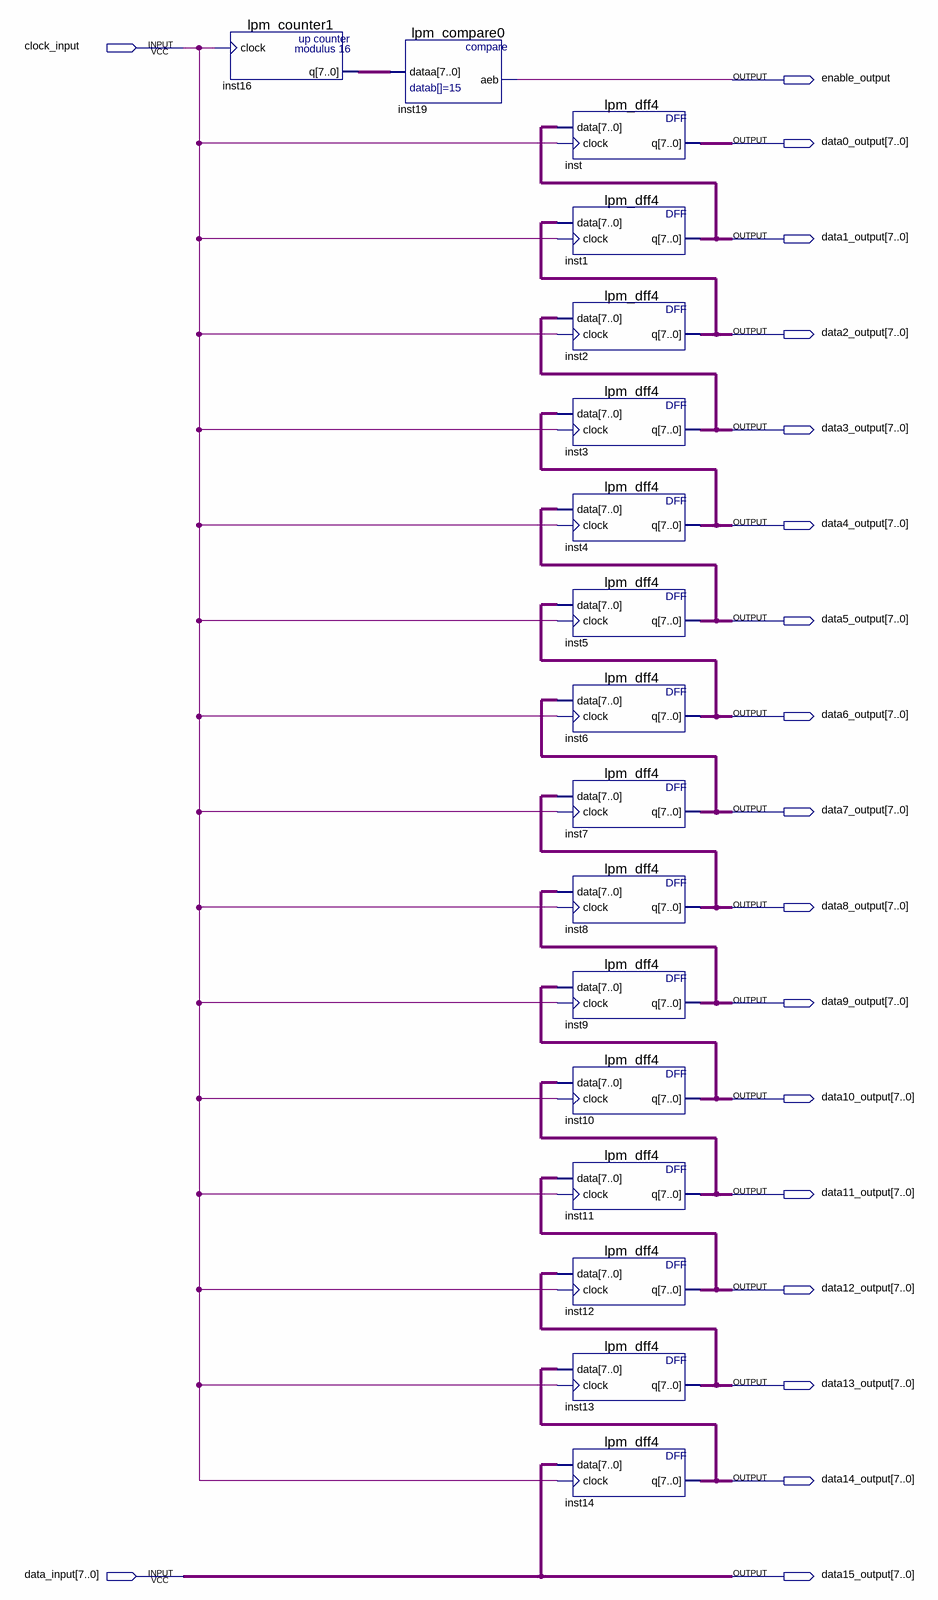
[diagram p0: schematic sheet]
// Quartus schematic to_parallel.bdf as structural Verilog: 17 symbols, 19 pins
module to_parallel (
  input  clock_input,
  input  [7:0] data_input,
  output enable_output,
  output [7:0] data0_output,
  output [7:0] data1_output,
  output [7:0] data2_output,
  output [7:0] data3_output,
  output [7:0] data4_output,
  output [7:0] data5_output,
  output [7:0] data6_output,
  output [7:0] data7_output,
  output [7:0] data8_output,
  output [7:0] data9_output,
  output [7:0] data10_output,
  output [7:0] data11_output,
  output [7:0] data12_output,
  output [7:0] data13_output,
  output [7:0] data14_output,
  output [7:0] data15_output
);

  wire [7:0] inst16_q;

  lpm_counter1 inst16 (.clock(clock_input), .q(inst16_q));
  lpm_compare0 inst19 (.dataa(inst16_q), .aeb(enable_output));
  lpm_dff4 inst (.data(data1_output), .clock(clock_input), .q(data0_output));
  lpm_dff4 inst1 (.data(data2_output), .clock(clock_input), .q(data1_output));
  lpm_dff4 inst2 (.data(data3_output), .clock(clock_input), .q(data2_output));
  lpm_dff4 inst3 (.data(data4_output), .clock(clock_input), .q(data3_output));
  lpm_dff4 inst4 (.data(data5_output), .clock(clock_input), .q(data4_output));
  lpm_dff4 inst5 (.data(data6_output), .clock(clock_input), .q(data5_output));
  lpm_dff4 inst6 (.data(data7_output), .clock(clock_input), .q(data6_output));
  lpm_dff4 inst7 (.data(data8_output), .clock(clock_input), .q(data7_output));
  lpm_dff4 inst8 (.data(data9_output), .clock(clock_input), .q(data8_output));
  lpm_dff4 inst9 (.data(data10_output), .clock(clock_input), .q(data9_output));
  lpm_dff4 inst10 (.data(data11_output), .clock(clock_input), .q(data10_output));
  lpm_dff4 inst11 (.data(data12_output), .clock(clock_input), .q(data11_output));
  lpm_dff4 inst12 (.data(data13_output), .clock(clock_input), .q(data12_output));
  lpm_dff4 inst13 (.data(data14_output), .clock(clock_input), .q(data13_output));
  lpm_dff4 inst14 (.data(data_input), .clock(clock_input), .q(data14_output));

  assign data15_output = data_input;
endmodule
